# Altium schematic sheet IMU.SchDoc
size A4; SheetNumber: 1; SheetTotal: 4
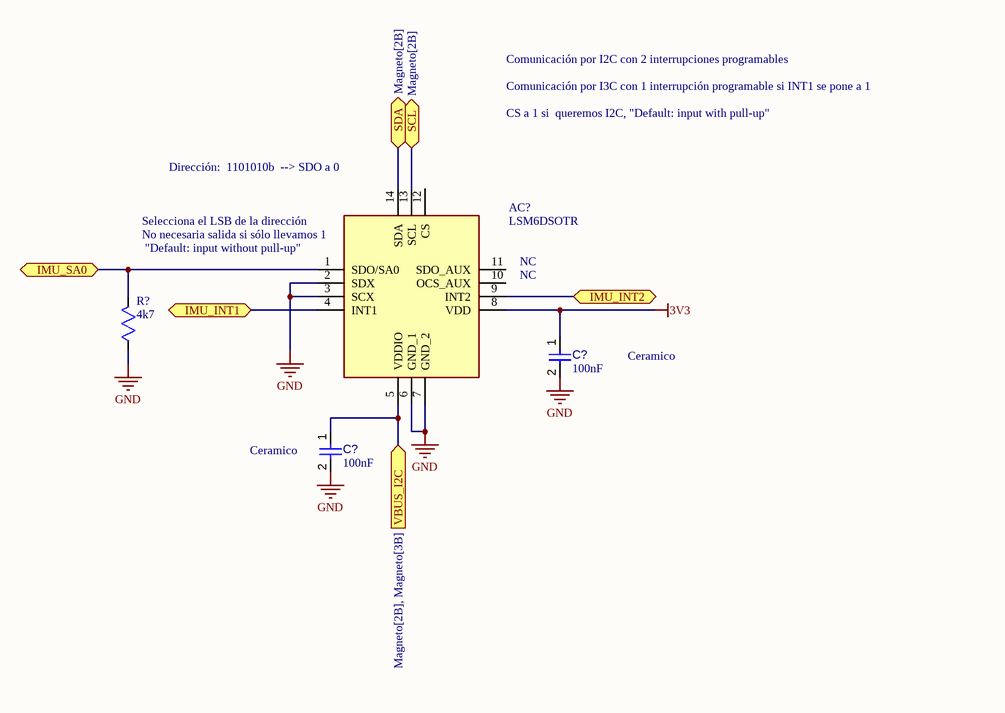
[diagram p0: IMU.SchDoc]

## Parts
(Parts that share a designator on the sheet are numbered #1, #2 ... from top to bottom, then left to right.)
AC?  LSM6DSOTR  [LGA-14(2.5X3X0.86)]
C?#1  value 100nF  [CAPC1005X56X25ML10T15]  (hidden comment: Capacitor 0.1 uF +/- 5% 16 V 0402)
C?#2  value 100nF  [CAPC1005X56X25ML10T15]  (hidden comment: Capacitor 0.1 uF +/- 5% 16 V 0402)
R?  Valor: 4k7  [RES SMD 0805]  (hidden comment: RES_0805_4k7)

## Ports
IMU_INT1 (bidir), IMU_INT2 (bidir), IMU_SA0 (bidir), SCL (bidir, see Magneto[2B]), SDA (bidir, see Magneto[2B]), VBUS_I2C (in, see Magneto[2B], Magneto[3B])

## Nets
3V3: AC?.8(VDD) C?#1.1
GND: AC?.2(SDX) AC?.3(SCX) AC?.6(GND_1) AC?.7(GND_2) C?#1.2 C?#2.2 R?.1
IMU_INT1: AC?.4(INT1) ; port IMU_INT1
IMU_INT2: AC?.9(INT2) ; port IMU_INT2
IMU_SA0: AC?.1(SDO/SA0) R?.2 ; port IMU_SA0
SCL: AC?.13(SCL) ; port SCL
SDA: AC?.14(SDA) ; port SDA
VBUS_I2C: AC?.5(VDDIO) C?#2.1 ; port VBUS_I2C

Not connected (* = marked no-connect by the designer): AC? 10(OCS_AUX) 11(SDO_AUX) 12(CS)

## Notes on the sheet
- Comunicación por I2C con 2 interrupciones programables
- Comunicación por I3C con 1 interrupción programable si INT1 se pone a 1
- CS a 1 si  queremos I2C, "Default: input with pull-up"
- (near AC?) Dirección:  1101010b  --> SDO a 0
- (near AC?) No necesaria salida si sólo llevamos 1
- (near AC?) Selecciona el LSB de la dirección
- (near AC?) "Default: input without pull-up"
- (near AC?) NC
- Ceramico
- (near C?#2) Ceramico

## Library data of the parts
AC? = LSM6DSOTR: Accelerometer; Manufacturer_Name: STMicroelectronics; Datasheet Link: https://www.st.com/resource/en/datasheet/lsm6dso.pdf; Manufacturer_Part_Number: LSM6DSOTR; Mouser Part Number: 511-LSM6DSOTR; Mouser Price/Stock: https://www.mouser.co.uk/ProductDetail/STMicroelectronics/LSM6DSOTR?qs=lc2O%252BfHJPVbD197C5c7oNw%3D%3D; Arrow Part Number: LSM6DSOTR; Arrow Price/Stock: https://www.arrow.com/en/products/lsm6dsotr/stmicroelectronics?region=nac
C?#1 C?#2 = CMP-001-00001-4: Chip Capacitor, 0.1 uF, +/- 5%, 16 V, 0402 (1005 Metric); Voltage Rating: 16V; Capacitor Type: Ceramic; Pins: 2; Min Operating Temperature: -55°C; Mounting Technology: SM; Max Operating Temperature: 125°C; RoHS Compliant: True; Case/Package: 0402; Tolerance: 5%
R? = CMP-088-000005-1: Resistencia 0805 4k7; RefDistribuidor: -; ComponentLink1Description: Link-Compra; Design Item ID: RES_0805_4k7; Fabricante: -; ComponentLink1URL: -; Source: ARUS2021.SchLib; ComponentLink2URL: -; RefFabricante: -; ComponentLink2Description: Datasheet; Distribuidor: -